# EAGLE design board (EAGLE 6.4.1)
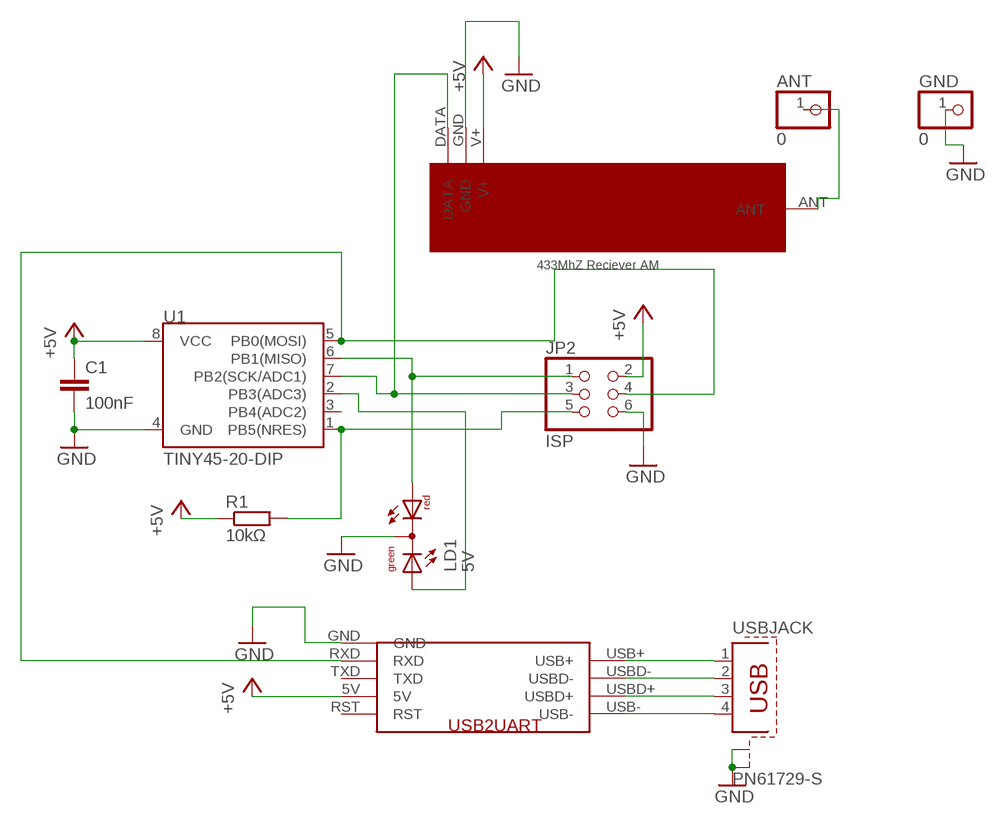
[diagram p0: schematic, sheet 1]

## Parts
ANT  0  PINHD-1X1  [1X01]
C1  100nF  C-EU050-024X044  [C050-024X044]
GND  0  PINHD-1X1  [1X01]
JP2  ISP  PINHD-2X3  [2X03]
LD1  5V  DUOLED-RG-C  [DUOLED-C-5MM]
R1  10kΩ  R-EU_0411/15  [0411/15]
U1  TINY45-20-DIP  ATTINY45TINY45-20-DIP  [DIP08]
U$1  USB2UART  [USB2UART]
U$2  433MHZREC  [433MHZREC]
USBJACK  PN61729-S  [PN61729-S]

## Nets
+5V: C1.1 JP2.2 R1.1 U1.8(VCC) U$1.5V U$2.V+
ANT: ANT.1 U$2.ANT
GND: C1.2 GND.1 JP2.6 LD1.C U1.4(GND) U$1.GND U$2.GND USBJACK.S1 USBJACK.S2
N$1: JP2.4 U1.5(PB0(MOSI)) U$1.RXD
N$2: JP2.3 U1.7(PB2(SCK/ADC1)) U$2.DATA
N$3: JP2.1 LD1.AR U1.6(PB1(MISO))
N$4: LD1.AX(AG) U1.2(PB3(ADC3))
N$5: JP2.5 R1.2 U1.1(PB5(NRES))
N$6: U$1.USB+ USBJACK.1
N$7: U$1.USBD- USBJACK.2
N$8: U$1.USBD+ USBJACK.3
N$9: U$1.USB- USBJACK.4
Unconnected: U1.3(PB4(ADC2)) U$1.RST U$1.TXD

## Library data of the parts
ANT GND = pinhead:PINHD-1X1: PIN HEADER
C1 = rcl:C-EU: CAPACITOR, European symbol
JP2 = pinhead:PINHD-2X3: PIN HEADER
LD1 = led:DUOLED-RG-C: DUO LED 2 colors (red/green), 5 mm, round, common Cathode www.ligitek.com or other producers.
R1 = rcl:R-EU_: RESISTOR, European symbol
U1 = SparkFun-DigitalIC:ATTINY45: Atmel 8-pin 2/4/8kB flash uC; PROD_ID: IC-09439
U$1 = PIECES:USB2UART
U$2 = PIECES:433MHZREC
USBJACK = con-berg:PN61729-S: BERG USB connector; OC_FARNELL: unknown; OC_NEWARK: unknown

## Board
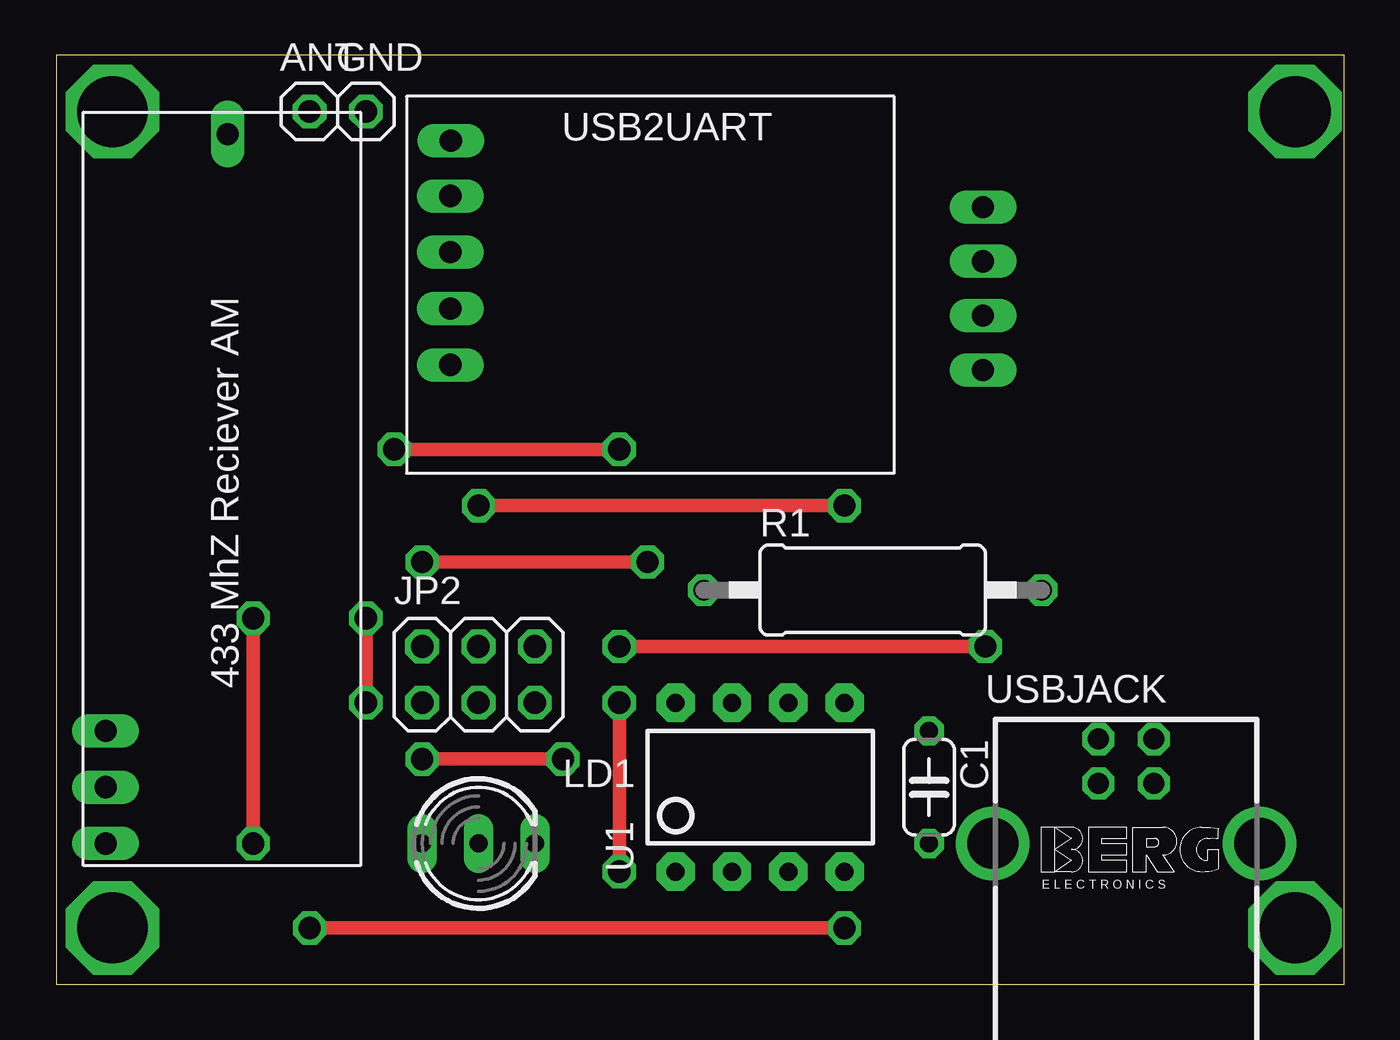
[diagram p1: board, top side]
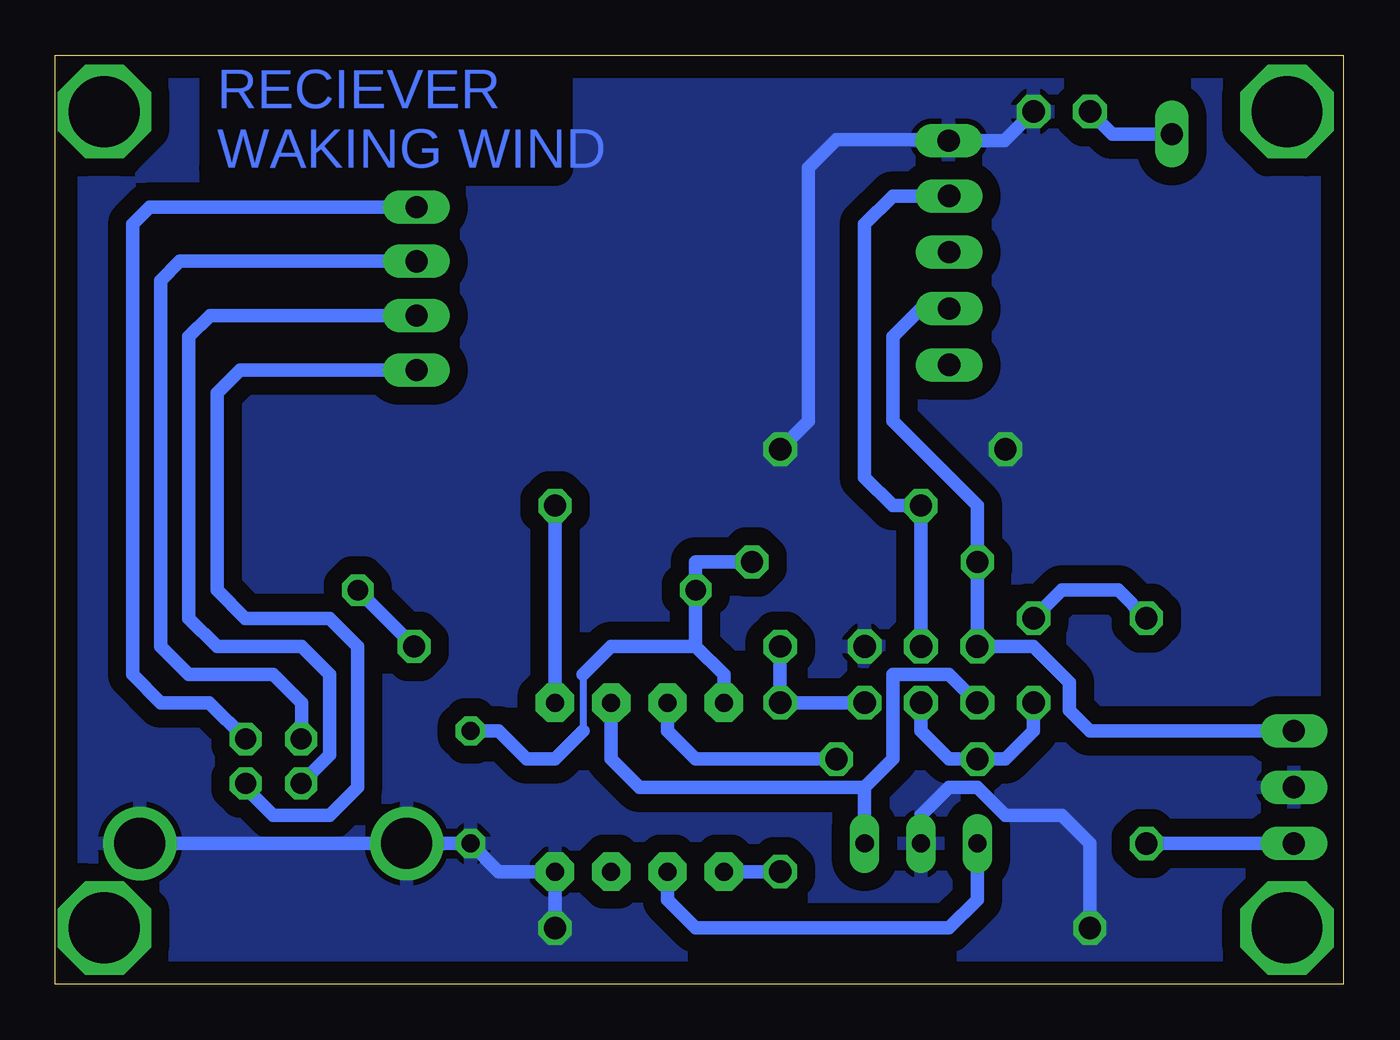
[diagram p2: board, bottom side, seen from below]

Size 58.09 x 41.9 mm. Coordinates in mm from the lower left corner, seen from the top.
Outline: 0,0 58.09,0 58.09,41.9 0,41.9 0,0
Copper layers (1*16): Top 0.035mm / dielectric 1.5mm / Bottom 0.035mm
Design rules "default": minimum track width 10mil, minimum drill 24mil, track to track 8mil, track to pad 8mil, pad to pad 8mil, via to via 8mil, smd to smd 8mil, copper to edge 40mil, drill to drill 8mil, minimum pad ring 10mil, minimum via ring 8mil, stop-mask expansion 4mil, vias tented up to drill 0mil, thermal gap 10mil

### Footprints (pad centres in the part's own frame; a part is rotated, then mirrored left to right if it is on the bottom)
1X01 = drill 1.016 octagon: 1 0,0
C050-024X044 = drill 0.813 octagon: 1 -2.54,0; 2 2.54,0
2X03 = drill 1.016 octagon: 1 -2.54,-1.27; 2 -2.54,1.27; 3 0,-1.27; 4 0,1.27; 5 2.54,-1.27; 6 2.54,1.27
DUOLED-C-5MM = drill 0.813 long: AR 2.54,0; AX -2.54,0; C 0,0
0411/15 = drill 0.914 octagon: 1 -7.62,0; 2 7.62,0
DIP08 = drill 0.813 pad 1.727 octagon: 1 -3.81,-3.81; 2 -1.27,-3.81; 3 1.27,-3.81; 4 3.81,-3.81; 5 3.81,3.81; 6 1.27,3.81; 7 -1.27,3.81; 8 -3.81,3.81
USB2UART = drill 1 long: 5V -27.94,-5.08; GND -27.915,2.5; RST -27.94,-7.62; RXD -27.94,0; TXD -27.94,-2.54; USB+ -3.915,-0.5; USB- -3.915,-7.85; USBD+ -3.915,-5.4; USBD- -3.915,-2.95
433MHZREC = drill 1 long: ANT 21,-3; DATA -11,2.5; GND -8.46,2.5; V+ -5.92,2.5
PN61729-S = drill 0.95 octagon: 1 1.25,4.71; 2 -1.25,4.71; 3 -1.25,2.71; 4 1.25,2.71 | drill 2.3 pad 2.9: S1 -6.02,0; S2 6.02,0

### Placement (x,y rotation side)
ANT  11.43,39.37 0 top
C1  39.37,8.89 270 top
GND  13.97,39.37 0 top
JP2  19.05,13.97 0 top
LD1  19.05,6.35 0 top
R1  36.83,17.78 0 top
U1  31.75,8.89 0 top
U$1  45.72,35.56 0 top
U$2  4.73,17.35 90 top
USBJACK  48.26,6.35 0 top

### Tracks (layer width: path | path; a pad name or v marks a point on that pad's centre or on a via)
+5V  (via drill 1)
  Top 0.61: v16.51,19.05 v26.67,19.05
  Bottom 0.305: 34.29,13.97 34.29,11.43
  Bottom 0.61: C1.1 38.1,11.43 36.83,10.16 35.56,10.16 34.29,11.43 | 34.29,13.97 33.02,15.24 29.21,15.24 | 29.21,15.24 27.94,13.97 U1.8 | 29.21,15.24 R1.1 29.21,19.05 v26.67,19.05 | U$1.5V 19.05,30.48 20.32,29.21 20.32,25.4 16.51,21.59 v16.51,19.05 JP2.2 13.97,15.24 12.35,13.62 12.35,12.35 11.43,11.43 U$2.V+
ANT
  Bottom 0.61: U$2.ANT 10.41,38.35 ANT.1
GND  (via drill 1)
  Top 0.61: v15.24,24.13 v25.4,24.13 | v35.56,2.54 v11.43,2.54
  Bottom 0.61: USBJACK.S2 USBJACK.S1 C1.2 38.1,5.08 U1.4 v35.56,2.54 | LD1.C 19.05,7.62 17.78,8.89 16.51,8.89 15.24,7.62 12.7,7.62 11.43,6.35 v11.43,2.54 | v25.4,24.13 24.13,25.4 24.13,36.83 22.86,38.1 17.84,38.1 U$1.GND 15.28,38.06 GND.1
  pour Bottom (isolate 0.813): 0,0 58.42,0 58.42,41.91 0,41.91
N$1  (via drill 1)
  Top 0.61: v19.05,21.59 v35.56,21.59
  Bottom 0.61: JP2.4 v19.05,21.59 20.32,21.59 21.59,22.86 21.59,34.29 20.32,35.56 U$1.RXD | v35.56,21.59 U1.5
N$2  (via drill 1)
  Top 0.61: v22.86,10.16 v16.51,10.16 | v13.97,16.51 v13.97,12.7 | v8.89,6.35 v8.89,16.51
  Bottom 0.61: JP2.3 19.05,11.43 17.78,10.16 v16.51,10.16 15.24,10.16 13.97,11.43 v13.97,12.7 | U1.7 30.48,11.43 29.21,10.16 v22.86,10.16 | v13.97,16.51 12.7,17.78 10.16,17.78 v8.89,16.51 | U$2.DATA v8.89,6.35
N$3
  Bottom 0.61: LD1.AR 21.59,8.89 | 21.59,8.89 20.32,10.16 20.32,13.97 17.78,13.97 JP2.1 | 21.59,8.89 31.75,8.89 33.02,10.16 U1.6
N$4
  Bottom 0.61: U1.2 30.48,3.81 29.21,2.54 17.78,2.54 16.51,3.81 LD1.AX
N$5  (via drill 1)
  Top 0.61: v25.4,5.08 v25.4,12.7 | v41.91,15.24 v25.4,15.24
  Bottom 0.61: U1.1 v25.4,5.08 | JP2.5 v25.4,12.7 v25.4,15.24 | R1.2 v41.91,15.24
N$6
  Bottom 0.61: U$1.USB+ 53.84,35.06 54.61,34.29 54.61,13.97 53.34,12.7 51.15,12.7 USBJACK.1
N$7
  Bottom 0.61: U$1.USBD- 52.48,32.61 53.34,31.75 53.34,15.24 52.07,13.97 48.26,13.97 46.99,12.7 46.99,11.08 USBJACK.2
N$8
  Bottom 0.61: U$1.USBD+ 51.12,30.16 52.07,29.21 52.07,16.51 50.8,15.24 46.99,15.24 45.72,13.97 45.72,10.35 USBJACK.3
N$9
  Bottom 0.61: U$1.USB- 49.76,27.71 50.8,26.67 50.8,17.78 49.53,16.51 45.72,16.51 44.45,15.24 44.45,8.89 45.72,7.62 48.26,7.62 49.53,8.89 49.53,9.04 USBJACK.4
N$10  (via drill 3.2)
  other vias: 2.54,39.37
N$11  (via drill 3.2)
  other vias: 55.88,39.37
N$12  (via drill 3.2)
  other vias: 55.88,2.54
N$13  (via drill 3.2)
  other vias: 2.54,2.54

### Text on the board
Bottom: RECIEVER / WAKING WIND